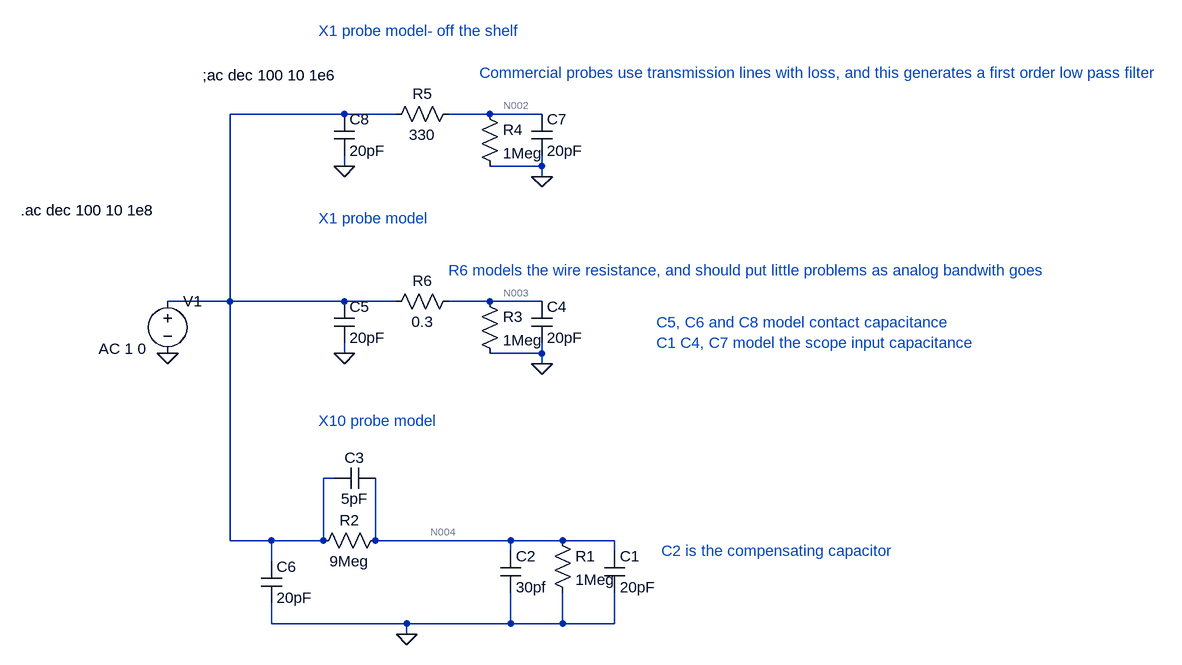
[diagram p0: schematic analog_bandwidth_bode_plot.asc]
analog_bandwidth_bode_plot.asc, the LTspice schematic file:
Version 4
SHEET 1 1556 680
WIRE -96 -480 -272 -480
WIRE -16 -480 -96 -480
WIRE 128 -480 64 -480
WIRE 208 -480 128 -480
WIRE -96 -400 -96 -416
WIRE 208 -400 208 -416
WIRE 208 -400 128 -400
WIRE 208 -384 208 -400
WIRE -272 -192 -272 -480
WIRE -272 -192 -368 -192
WIRE -96 -192 -272 -192
WIRE -16 -192 -96 -192
WIRE 128 -192 64 -192
WIRE 208 -192 128 -192
WIRE -96 -112 -96 -128
WIRE 208 -112 208 -128
WIRE 208 -112 128 -112
WIRE 208 -96 208 -112
WIRE -112 80 -128 80
WIRE -272 176 -272 -192
WIRE -208 176 -272 176
WIRE -128 176 -128 80
WIRE -128 176 -208 176
WIRE -48 176 -48 80
WIRE 160 176 -48 176
WIRE 240 176 160 176
WIRE 320 176 240 176
WIRE 160 192 160 176
WIRE 320 192 320 176
WIRE -208 208 -208 176
WIRE -208 304 -208 272
WIRE 0 304 -208 304
WIRE 160 304 160 256
WIRE 160 304 0 304
WIRE 240 304 240 256
WIRE 240 304 160 304
WIRE 320 304 320 256
WIRE 320 304 240 304
WIRE 0 320 0 304
FLAG 0 320 0
FLAG 208 -96 0
FLAG -96 -112 0
FLAG -368 -112 0
FLAG 208 -384 0
FLAG -96 -400 0
SYMBOL cap 304 192 R0
SYMATTR InstName C1
SYMATTR Value 20pF
SYMBOL res 224 160 R0
SYMATTR InstName R1
SYMATTR Value 1Meg
SYMBOL cap 144 192 R0
SYMATTR InstName C2
SYMATTR Value 30pf
SYMBOL res -32 160 R90
WINDOW 0 0 56 VBottom 2
WINDOW 3 32 56 VTop 2
SYMATTR InstName R2
SYMATTR Value 9Meg
SYMBOL cap -48 64 R90
WINDOW 0 0 32 VBottom 2
WINDOW 3 32 32 VTop 2
SYMATTR InstName C3
SYMATTR Value 5pF
SYMBOL cap 192 -192 R0
SYMATTR InstName C4
SYMATTR Value 20pF
SYMBOL res 112 -208 R0
SYMATTR InstName R3
SYMATTR Value 1Meg
SYMBOL cap -112 -192 R0
SYMATTR InstName C5
SYMATTR Value 20pF
SYMBOL cap -224 208 R0
SYMATTR InstName C6
SYMATTR Value 20pF
SYMBOL cap 192 -480 R0
SYMATTR InstName C7
SYMATTR Value 20pF
SYMBOL res 112 -496 R0
SYMATTR InstName R4
SYMATTR Value 1Meg
SYMBOL cap -112 -480 R0
SYMATTR InstName C8
SYMATTR Value 20pF
SYMBOL res 80 -496 R90
WINDOW 0 0 56 VBottom 2
WINDOW 3 32 56 VTop 2
SYMATTR InstName R5
SYMATTR Value 330
SYMBOL voltage -368 -208 R0
WINDOW 123 -106 89 Left 2
WINDOW 39 0 0 Left 0
SYMATTR InstName V1
SYMATTR Value ""
SYMATTR Value2 AC 1 0
SYMBOL res 80 -208 R90
WINDOW 0 0 56 VBottom 2
WINDOW 3 32 56 VTop 2
SYMATTR InstName R6
SYMATTR Value 0.3
TEXT -594 -332 Left 2 !.ac dec 100 10 1e8
TEXT 384 -160 Left 2 ;C5, C6 and C8 model contact capacitance
TEXT 384 -128 Left 2 ;C1 C4, C7 model the scope input capacitance
TEXT 392 192 Left 2 ;C2 is the compensating capacitor
TEXT -136 -320 Left 2 ;X1 probe model
TEXT -136 -8 Left 2 ;X10 probe model
TEXT -314 -540 Left 2 !;ac dec 100 10 1e6
TEXT -136 -608 Left 2 ;X1 probe model- off the shelf
TEXT 112 -544 Left 2 ;Commercial probes use transmission lines with loss, and this generates a first order low pass filter
TEXT 64 -240 Left 2 ;R6 models the wire resistance, and should put little problems as analog bandwith goes

The netlist it stands for:
* analog_bandwidth_bode_plot.asc
C1 N004 0 20pF
R1 N004 0 1Meg
C2 N004 0 30pf
R2 N004 N001 9Meg
C3 N004 N001 5pF
C4 N003 0 20pF
R3 N003 0 1Meg
C5 N001 0 20pF
C6 N001 0 20pF
C7 N002 0 20pF
R4 N002 0 1Meg
C8 N001 0 20pF
R5 N002 N001 330
V1 N001 0 AC 1 0
R6 N003 N001 0.3
.ac dec 100 10 1e8
* C5, C6 and C8 model contact capacitance
* C1 C4, C7 model the scope input capacitance
* C2 is the compensating capacitor
* X1 probe model
* X10 probe model
;ac dec 100 10 1e6
* X1 probe model- off the shelf
* Commercial probes use transmission lines with loss, and this generates a first order low pass filter
* R6 models the wire resistance, and should put little problems as analog bandwith goes
.backanno
.end

* Results of the author's LTspice run, read from the files saved beside the schematic
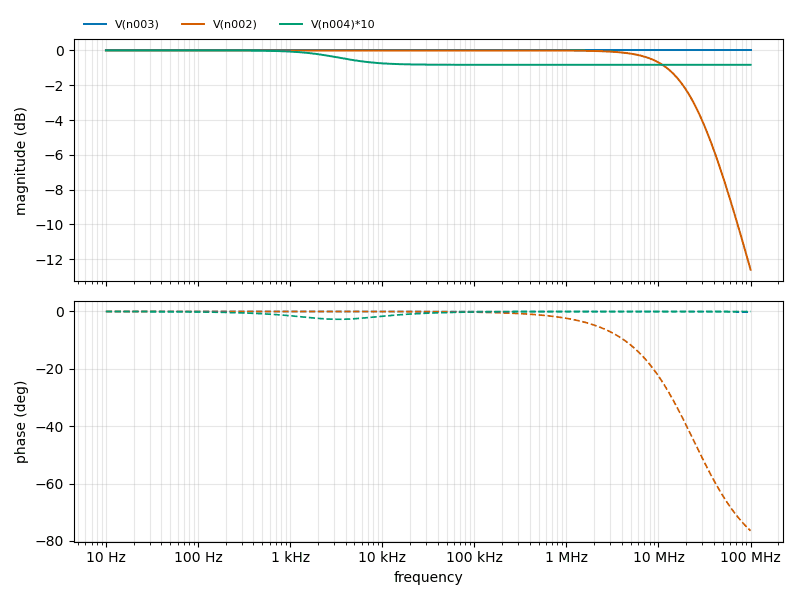
[diagram p1: AC Analysis of analog_bandwidth_bode_plot.asc, plotted from the saved traces]
* AC Analysis, 1 run:
*   V(n003): -0.00 dB at 10 Hz, -0.00 dB at 100 MHz, peak -0.00 dB at 263 Hz
*   V(n002): -0.00 dB at 10 Hz, -12.60 dB at 100 MHz, peak -0.00 dB at 10 Hz, 3 dB below the peak at 24.12 MHz
*   V(n004)*10: -0.00 dB at 10 Hz, -0.83 dB at 100 MHz, peak -0.00 dB at 10 Hz